# EAGLE design ArduinoNano (EAGLE 8.4.1)
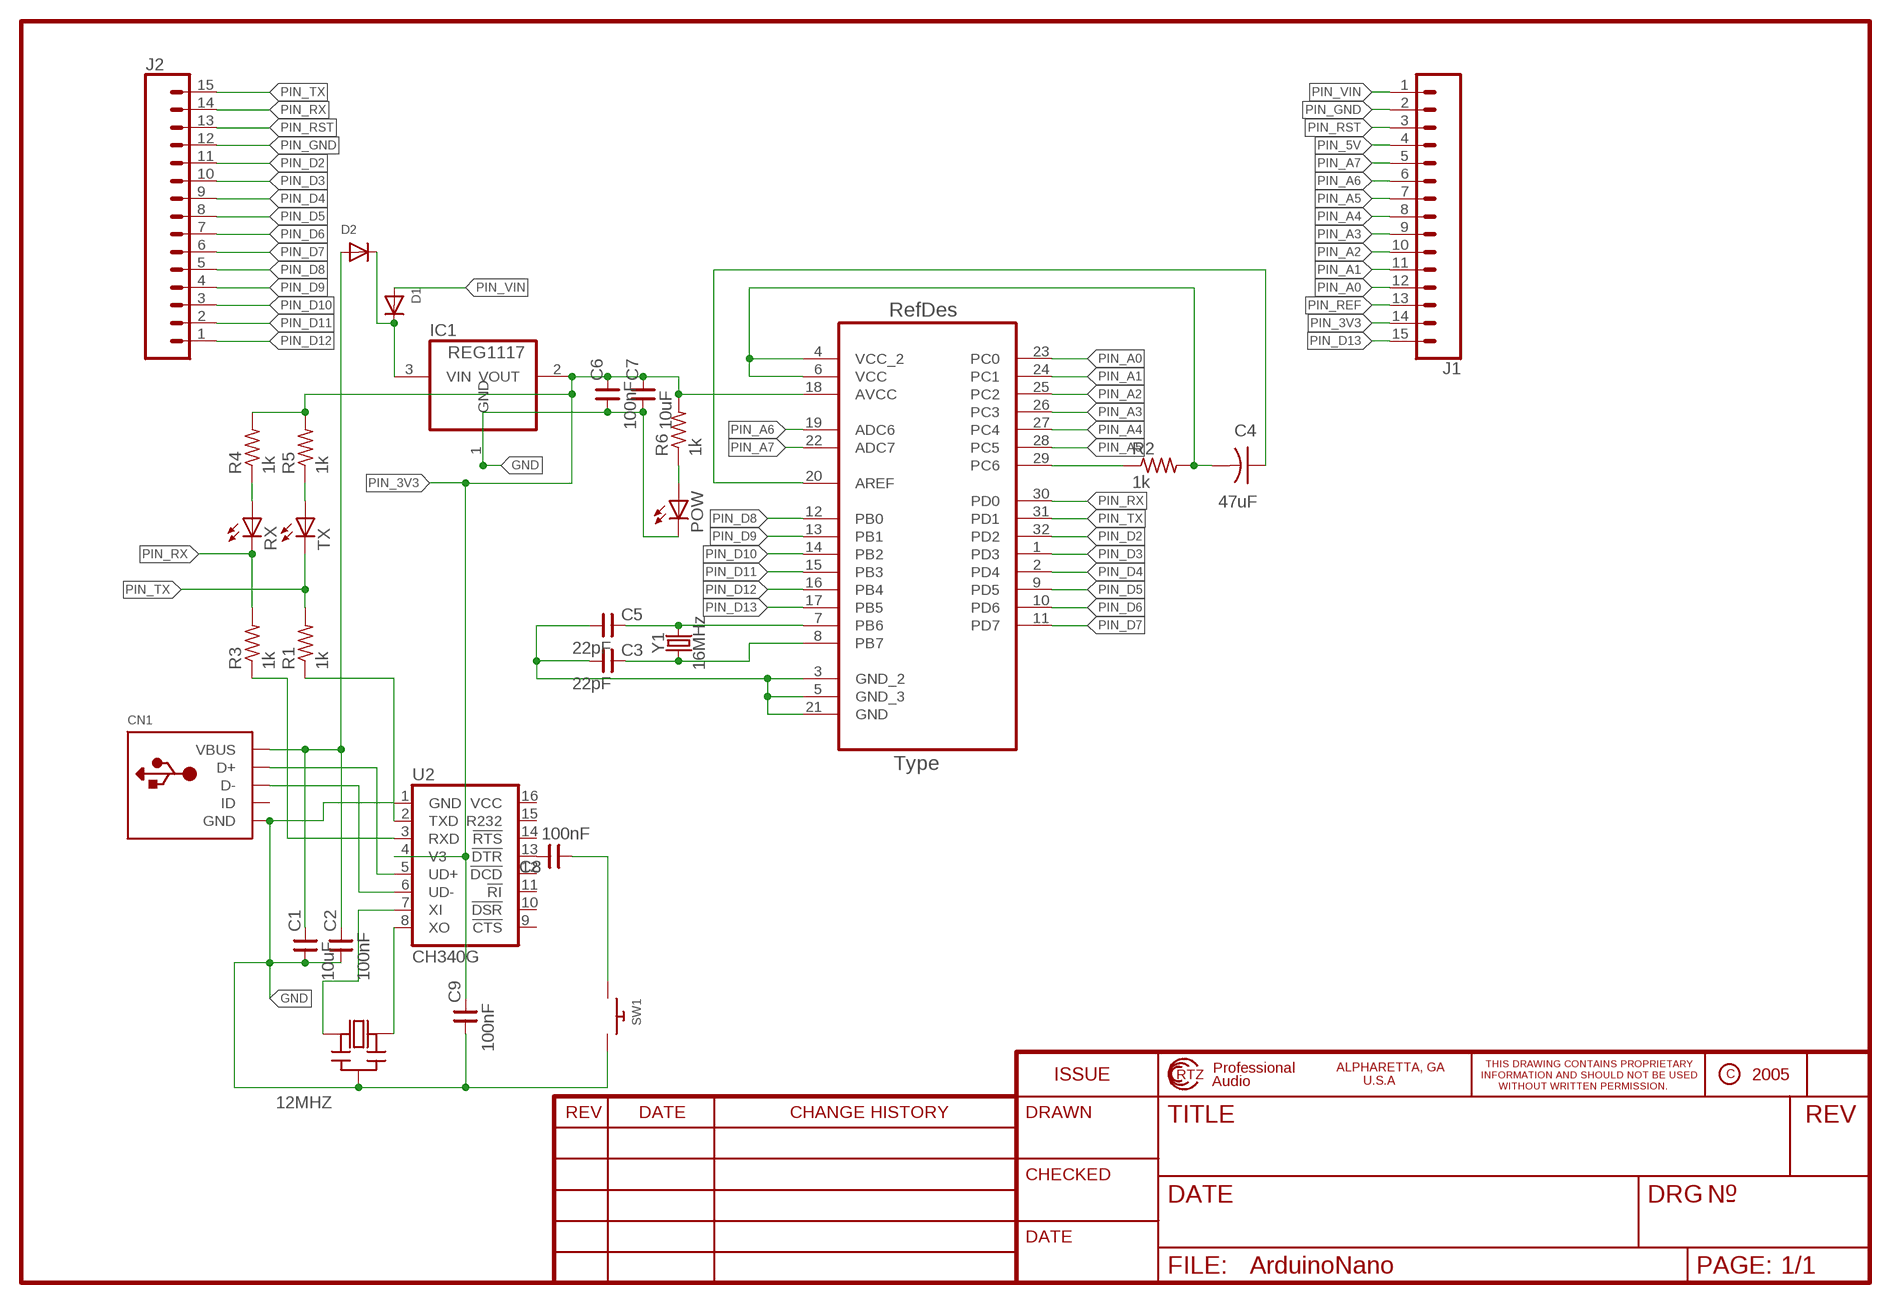
[diagram p0: schematic, sheet 1]

## Parts
12MHZ  CERMOSCILL-THM  [CERM_OSC]
C1  10uF  CNP-0603  [0603]
C2  100nF  CNP-0603  [0603]
C3  22pF  CNP-0603  [0603]
C4  47uF  C-USC1210  [C1210]
C5  22pF  CNP-0603  [0603]
C6  100nF  CNP-0603  [0603]
C7  10uF  CNP-0603  [0603]
C8  100nF  CNP-0603  [0603]
C9  100nF  CNP-0603  [0603]
CN1  USBMINIB  [USB-MINIB]
D1  DIODESOD-323F  [SOD-323F]
D2  DIODESOD-323F  [SOD-323F]
IC1  REG1117  [SOT223]
J1  CONN_15  [1X15]
J2  CONN_15  [1X15]
POW  LEDCHIP-LED0603  [CHIP-LED0603]
R1  1k  R-US_R0603  [R0603]
R2  1k  R-US_R0603  [R0603]
R3  1k  R-US_R0603  [R0603]
R4  1k  R-US_R0603  [R0603]
R5  1k  R-US_R0603  [R0603]
R6  1k  R-US_R0603  [R0603]
RX  LEDCHIPLED_0603  [CHIPLED_0603]
SW1  SWITCH_PUSHBUTTONEVQ-PE  [TACT_PANA-EVQ]
TX  LEDCHIPLED_0603  [CHIPLED_0603]
U1  ATMEGA328P-AU  [QFP80P900X900X120-32N]
U2  CH340G  CH340GSMD  [SO016]
Y1  16MHz  CRYSTAL-16MHZPTH-HC49US  [HC49US]

## Nets
GND: 12MHZ.P$2(GND) C1.1 C2.1 C6.1 C7.1 C9.1 CN1.GND IC1.1(GND) POW.C SW1.P$2 U2.1(GND)
N$1: C5.2 U1.7(PB6) Y1.2
N$2: C3.2 U1.8(PB7) Y1.1
N$3: C3.1 C5.1 U1.3(GND_2) U1.5(GND_3) U1.21(GND)
N$4: C4.1 U1.20(AREF)
N$5: R2.1 U1.29(PC6)
N$6: C4.2 R2.2 U1.4(VCC_2) U1.6(VCC)
N$9: R4.1 RX.A
N$10: R5.1 TX.A
N$11: 12MHZ.P$1(IN) U2.7(XI)
N$12: C1.2 C2.2 CN1.VBUS D2.A
N$13: CN1.D+ U2.5(UD+)
N$14: CN1.D- U2.6(UD-)
N$15: 12MHZ.P$3(OUT) U2.8(XO)
N$16: R3.1 U2.3(RXD)
N$17: R1.1 U2.2(TXD)
N$18: D1.C D2.C IC1.3(VIN)
N$19: C8.2 U2.13(!DTR)
N$21: POW.A R6.1
N$22: C8.1 SW1.P$1
PIN_3V3: C6.2 C7.2 C9.2 IC1.2(VOUT) J1.14 R4.2 R5.2 R6.2 U1.18(AVCC) U2.4(V3)
PIN_5V: J1.4
PIN_A0: J1.12 U1.23(PC0)
PIN_A1: J1.11 U1.24(PC1)
PIN_A2: J1.10 U1.25(PC2)
PIN_A3: J1.9 U1.26(PC3)
PIN_A4: J1.8 U1.27(PC4)
PIN_A5: J1.7 U1.28(PC5)
PIN_A6: J1.6 U1.19(ADC6)
PIN_A7: J1.5 U1.22(ADC7)
PIN_D2: J2.11 U1.32(PD2)
PIN_D3: J2.10 U1.1(PD3)
PIN_D4: J2.9 U1.2(PD4)
PIN_D5: J2.8 U1.9(PD5)
PIN_D6: J2.7 U1.10(PD6)
PIN_D7: J2.6 U1.11(PD7)
PIN_D8: J2.5 U1.12(PB0)
PIN_D9: J2.4 U1.13(PB1)
PIN_D10: J2.3 U1.14(PB2)
PIN_D11: J2.2 U1.15(PB3)
PIN_D12: J2.1 U1.16(PB4)
PIN_D13: J1.15 U1.17(PB5)
PIN_GND: J1.2 J2.12
PIN_REF: J1.13
PIN_RST: J1.3 J2.13
PIN_RX: J2.14 R3.2 RX.C U1.30(PD0)
PIN_TX: J2.15 R1.2 TX.C U1.31(PD1)
PIN_VIN: D1.A J1.1
Unconnected: CN1.ID U2.9(!CTS) U2.10(!DSR) U2.11(!RI) U2.12(!DCD) U2.14(!RTS) U2.15(R232) U2.16(VCC)

## Library data of the parts
12MHZ = adafruit:CERMOSCILL: Ceramic oscillator with built in capacitors such as ZTT-12MHz http://www.ladyada.net/library/eagle
C1-C3 C5-C9 = cap-master:CNP-: NON-POLARIZED CAP
C4 = adafruit:C-US: CAPACITOR, American symbol
CN1 = adafruit:USB: USB Connectors USBMINIB - Surface Mount Female Mini-B USB Connector 4UConnector: 06564 By microbuilder.eu Thru-hole RA Female Mini-B USB Connector 4UConnector: 18732 By ladyada.net
D1 D2 = adafruit:DIODE: Diode SMADIODE - SMA Surface Mount Package 20V 1A Schottky Diode Digikey: 641-1014-6-ND DO-1N4148 - Through Hole Small Current Diode SOD-123 20V 1 A (.5mV Vf) Schottky Diode - Digikey: MBRX120TPMSCT-ND SOD-323 10V 570mA (.38mV Vf, 3ns) Schottky Diode - Digikey: ZLLS410CT-ND SOD-523 30V 30mA Schottky Diode (RB751S-40TE61) - Digikey: RB751S-40TE61CT-ND SOT23-R/W - SOT23 Package (R = Solder Paste/Reflow Ovens, W = Hand-Soldering) BAT54Film 40V 300mA - Digikey: 497-7162-1-ND
IC1 = burr-brown:REG1117: 800mA and 1A Low Dropout (LDO) Positive Regulator 1.8V, 2.5V, 2.85V, 3.3V, 5V, and Adj; MPN: REG1117; OC_FARNELL: 1097566; OC_NEWARK: 14P6981
J1 J2 = SparkFun-Connectors:CONN_15: Multi connection point. Often used as Generic Header-pin footprint for 0.1 inch spaced/style header connections On any of the 0.1 inch spaced packages, you can populate with these: Break Away Headers - Straight <https://www.sparkfun.com/products/116> (PRT-00116) Break Away Male Headers - Right Angle <https://www.sparkfun.com/products/553> (PRT-00553) Female Headers <https://www.sparkfun.com/products/115> (PRT-00115) Break Away Headers - Machine Pin <https://www.sparkfun.com/products/117> (PRT-00117) Break Away Female Headers - Swiss Machine Pin <https://www.sparkfun.com/products/743> (PRT-00743) For SCREWTERMINALS and SPRING TERMINALS visit here: Screw Terimnals on SparkFun.com <https://www.sparkfun.com/search/results?term=Screw+Terminals> (5mm/3.5mm/2.54mm spacing) This device is also useful as a general connection point to wire up your design to another part of your project. Our various solder wires solder well into these plated through hole pads. Hook-Up Wire - Assortment (Stranded, 22 AWG) <https://www.sparkfun.com/products/11375> (PRT-11375) Hook-Up Wire - Assortment (Solid Core, 22 AWG) <https://www.sparkfun.com/products/11367> (PRT-11367) View the entire wire category on our website here <https://www.sparkfun.com/categories/141> Special notes: Molex polarized connector foot print use with SKU : PRT-08231 with associated crimp pins and housings. 1MM SMD Version SKU: PRT-10208 NOTES ON THE VARIANTS LOCK and LOCK_LONGPADS... This footprint was designed to help hold the alignment of a through-hole component (i.e. 6-pin header) while soldering it into place. You may notice that each hole has been shifted either up or down by 0.005 of an inch from it's more standard position (which is a perfectly straight line). This slight alteration caused the pins (the squares in the middle) to touch the edges of the holes. Because they are alternating, it causes a "brace" to hold the component in place. 0.005 has proven to be the perfect amount of "off-center" position when using our standard breakaway headers. Although looks a little odd when you look at the bare footprint, once you have a header in there, the alteration is very hard to notice. Also,if you push a header all the way into place, it is covered up entirely on the bottom side.
POW RX TX = adafruit:LED: LED OSRAM: - CHIPLED LG R971, LG N971, LY N971, LG Q971, LY Q971, LO R971, LY R971 LH N974, LH R974 LS Q976, LO Q976, LY Q976 LO Q996 - Hyper CHIPLED LW Q18S LB Q993, LB Q99A, LB R99A - SideLED LS A670, LO A670, LY A670, LG A670, LP A670 LB A673, LV A673, LT A673, LW A673 LH A674 LY A675 LS A676, LA A676, LO A676, LY A676, LW A676 LS A679, LY A679, LG A679 - Hyper Micro SIDELED® LS Y876, LA Y876, LO Y876, LY Y876 LT Y87S - SmartLED LW L88C, LW L88S LB L89C, LB L89S, LG L890 LS L89K, LO L89K, LY L89K LS L896, LA L896, LO L896, LY L896 - TOPLED LS T670, LO T670, LY T670, LG T670, LP T670 LSG T670, LSP T670, LSY T670, LOP T670, LYG T670 LG T671, LOG T671, LSG T671 LB T673, LV T673, LT T673, LW T673 LH T674 LS T676, LA T676, LO T676, LY T676, LB T676, LH T676, LSB T676, LW T676 LB T67C, LV T67C, LT T67C, LS T67K, LO T67K, LY T67K, LW E67C LS E67B, LA E67B, LO E67B, LY E67B, LB E67C, LV E67C, LT E67C LW T67C LS T679, LY T679, LG T679 LS T770, LO T770, LY T770, LG T770, LP T770 LB T773, LV T773, LT T773, LW T773 LH T774 LS E675, LA E675, LY E675, LS T675 LS T776, LA T776, LO T776, LY T776, LB T776 LHGB T686 LT T68C, LB T68C - Hyper Mini TOPLED® LB M676 - Mini TOPLED Santana® LG M470 LS M47K, LO M47K, LY M47K Source: http://www.osram.convergy.de/
R1-R6 = adafruit:R-US_: RESISTOR, American symbol
SW1 = adafruit:SWITCH_PUSHBUTTON: Buttons SOFTTOUCHSMD_SJ - Soft touch temporary push button (Super Junk Akihabara) Compatible with SKPMANE010 [Mouser: 688-SKPMAN] C&K_KSS = Digikey: KSS221GLFS
U1 = Atmel-ATMEGA328P-AU:ATMEGA328P-AU; DESCRIPTION: 8-bit Microcontroller with In-System Programmable Flash; MPN: ATMEGA328P-AU; OC_FARNELL: 1715486; OC_NEWARK: 14R4631; PACKAGE: TQFP-32; SUPPLIER: Atmel
U2 = Serial-Basic:CH340G: A simple USB 2.0 to Serial IC.; PROD_ID: IC-13498
Y1 = SparkFun-Clocks:CRYSTAL-16MHZ: 16MHz Crystal Digikey Example <http://www.digikey.com/product-search/en?keywords=535-9122-1-ND> Frequency: 16MHz Frequency Stability: ±50ppm Frequency Tolerance: ±20ppm Load Capacitance: 18pF SparkFun Products: Pro Micro -5V/16MHz <https://www.sparkfun.com/products/12640> SparkFun Serial Enabled LCD Kit <https://www.sparkfun.com/products/10097>; PROD_ID: XTAL-08181; SF_ID: COM-00536

## Board
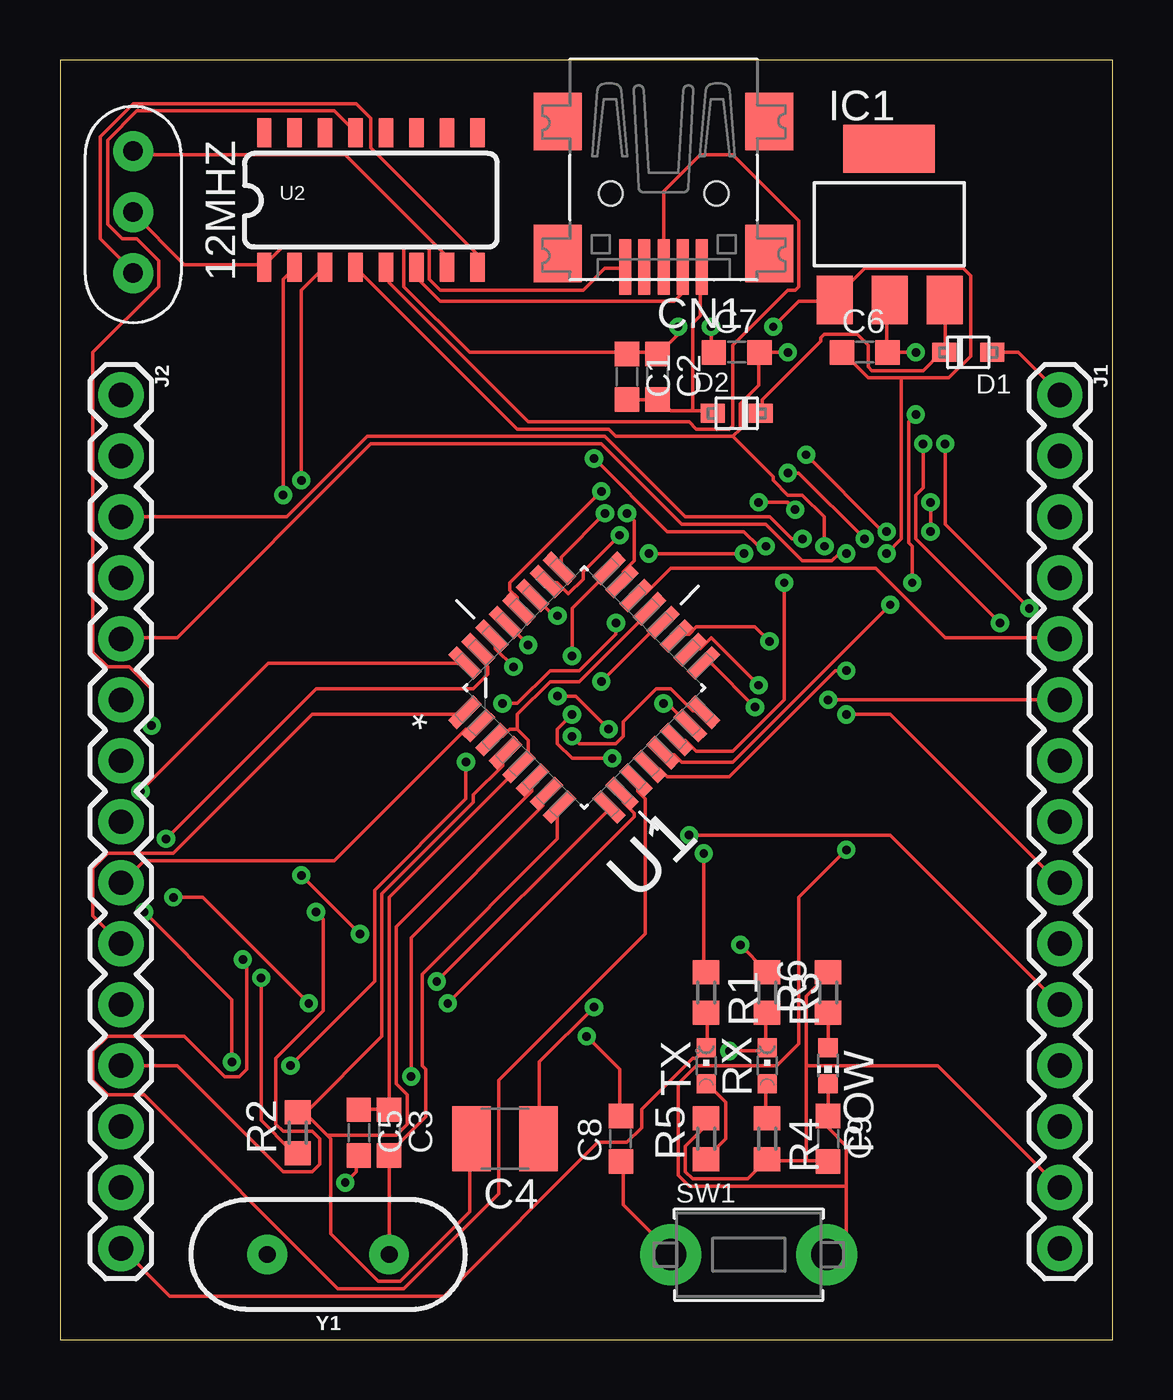
[diagram p1: board, top side]
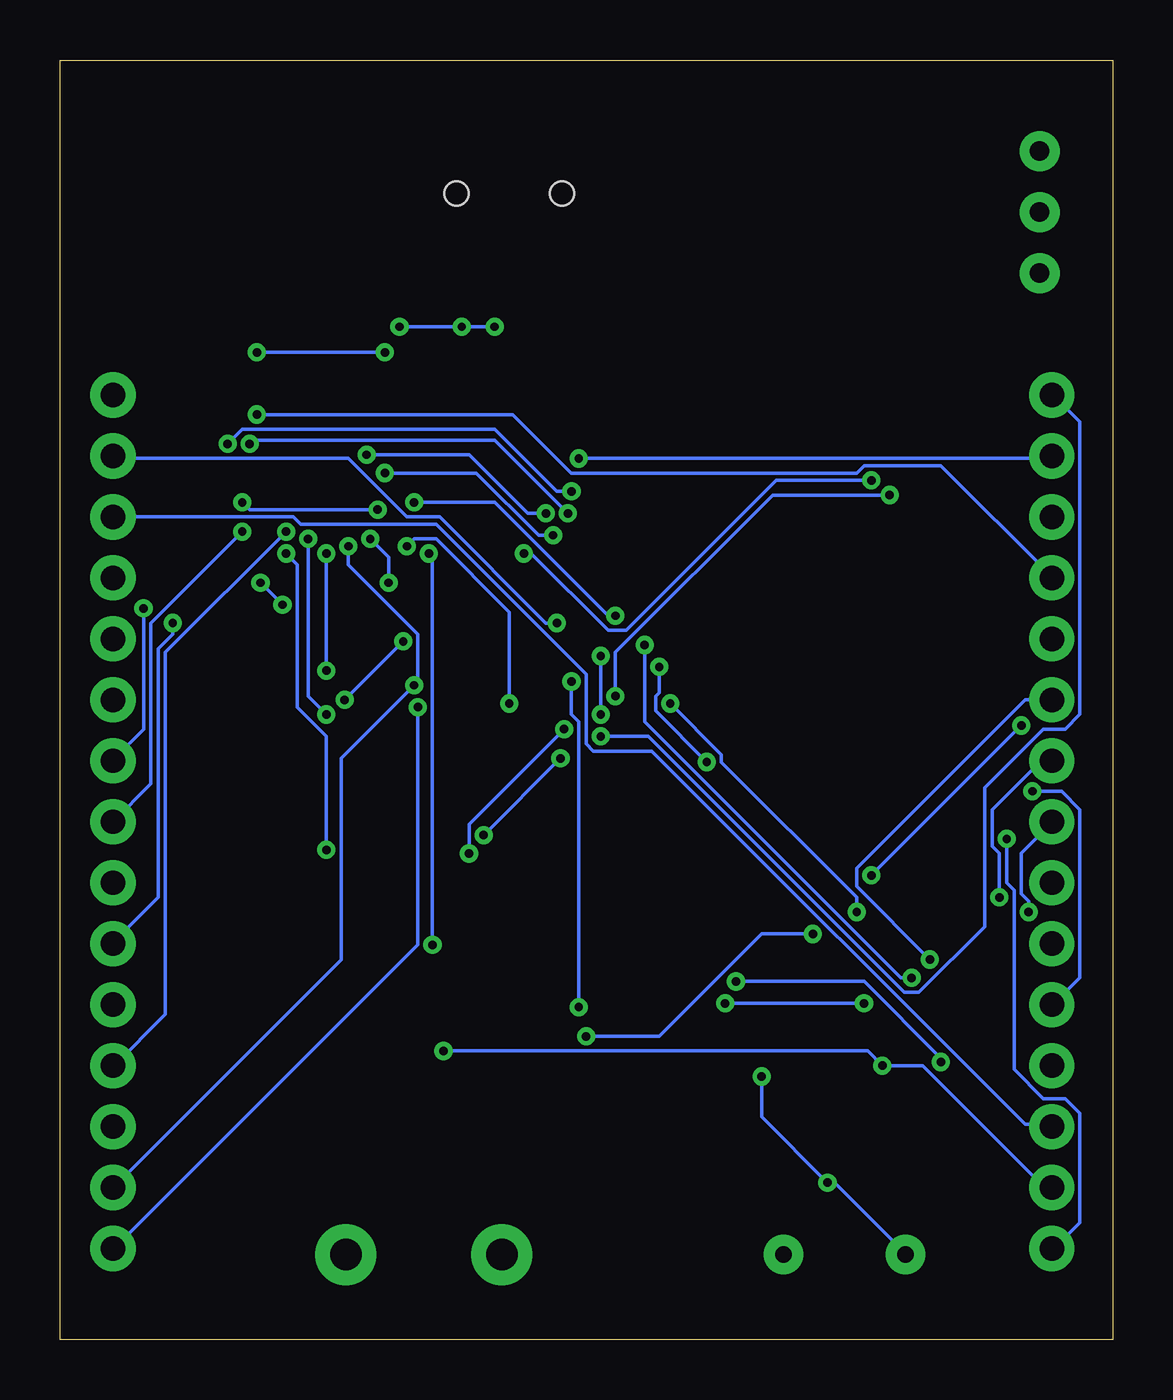
[diagram p2: board, bottom side, seen from below]

Size 43.87 x 53.33 mm. Coordinates in mm from the lower left corner, seen from the top.
Outline: 0,0 43.87,0 43.87,53.33 0,53.33 0,0
Copper layers (1*16): Top 0.035mm / dielectric 1.5mm / Bottom 0.035mm
Design rules "default": minimum track width 6mil, minimum drill 0.35mm, track to track 6mil, track to pad 6mil, pad to pad 6mil, via to via 6mil, smd to smd 6mil, copper to edge 40mil, drill to drill 6mil, minimum pad ring 10mil, minimum via ring 8mil, stop-mask expansion 4mil, vias tented up to drill 0mil, thermal gap 10mil

### Footprints (pad centres in the part's own frame; a part is rotated, then mirrored left to right if it is on the bottom)
CERM_OSC = drill 0.813 pad 1.676: P$1 -2.54,0; P$2 0,0; P$3 2.54,0
0603 = smd 1.016 x 1.016: 1 -0.953,0; 2 0.953,0
C1210 = smd 1.6 x 2.7: 1 -1.4,0; 2 1.4,0
USB-MINIB = smd 0.5 x 2.308: D+ 0,4.064; D- -0.8,4.064; GND 1.6,4.064; ID 0.8,4.064; VBUS -1.6,4.064 | smd 2 x 2.4: GND1 -4.4,-2; GND2 -4.4,3.5; GND3 4.4,3.5; GND4 4.4,-2 | hole 1: -2.2,1; 2.2,1
SOD-323F = smd 1 x 0.8: A -1,0; C 1,0
SOT223 = smd 1.499 x 2.007: 1 -2.261,-3.15; 2 0.025,-3.15; 3 2.311,-3.15 | smd 3.81 x 2.007: 4 0,3.15
1X15 = drill 1.016 pad 1.88: 1 0,0; 2 2.54,0; 3 5.08,0; 4 7.62,0; 5 10.16,0; 6 12.7,0; 7 15.24,0; 8 17.78,0; 9 20.32,0; 10 22.86,0; 11 25.4,0; 12 27.94,0; 13 30.48,0; 14 33.02,0; 15 35.56,0
CHIP-LED0603 = smd 0.8 x 0.8: A 0,-0.75; C 0,0.75
R0603 = smd 1 x 1.1: 1 -0.85,0; 2 0.85,0
CHIPLED_0603 = smd 0.8 x 0.8: A 0,-0.75; C 0,0.75
TACT_PANA-EVQ = drill 1.3 pad 2.54: P$1 -3.25,0; P$2 3.25,0
QFP80P900X900X120-32N = smd 1.473 x 0.508: 1 -4.242,2.794; 2 -4.242,2.007; 3 -4.242,1.194; 4 -4.242,0.406; 5 -4.242,-0.406; 6 -4.242,-1.194; 7 -4.242,-2.007; 8 -4.242,-2.794; 17 4.242,-2.794; 18 4.242,-2.007; 19 4.242,-1.194; 20 4.242,-0.406; 21 4.242,0.406; 22 4.242,1.194; 23 4.242,2.007; 24 4.242,2.794 | smd 0.508 x 1.473: 9 -2.794,-4.242; 10 -2.007,-4.242; 11 -1.194,-4.242; 12 -0.406,-4.242; 13 0.406,-4.242; 14 1.194,-4.242; 15 2.007,-4.242; 16 2.794,-4.242; 25 2.794,4.242; 26 2.007,4.242; 27 1.194,4.242; 28 0.406,4.242; 29 -0.406,4.242; 30 -1.194,4.242; 31 -2.007,4.242; 32 -2.794,4.242
SO016 = smd 0.6 x 1.2: 1 -4.445,-2.8; 2 -3.175,-2.8; 3 -1.905,-2.8; 4 -0.635,-2.8; 5 0.635,-2.8; 6 1.905,-2.8; 7 3.175,-2.8; 8 4.445,-2.8; 9 4.445,2.8; 10 3.175,2.8; 11 1.905,2.8; 12 0.635,2.8; 13 -0.635,2.8; 14 -1.905,2.8; 15 -3.175,2.8; 16 -4.445,2.8
HC49US = drill 0.7 pad 1.651: 1 -2.54,0; 2 2.54,0

### Placement (x,y rotation side)
12MHZ  3.05,46.99 270 top
C1  23.62,40.13 270 top
C2  24.89,40.13 270 top
C3  13.72,8.64 270 top
C4  18.54,8.38 180 top
C5  12.45,8.64 270 top
C6  33.53,41.15 0 top
C7  28.19,41.15 0 top
C8  23.37,8.38 90 top
C9  32,8.38 270 top
CN1  25.15,48.77 180 top
D1  37.85,41.15 180 top
D2  28.19,38.61 0 top
IC1  34.54,46.48 0 top
J1  41.66,39.37 270 top
J2  2.54,39.37 270 top
POW  32,11.43 180 top
R1  26.92,14.48 270 top
R2  9.91,8.64 90 top
R3  29.46,14.48 270 top
R4  29.46,8.38 270 top
R5  26.92,8.38 90 top
R6  32,14.48 90 top
RX  29.46,11.43 0 top
SW1  28.7,3.56 0 top
TX  26.92,11.43 0 top
U1  21.84,27.18 45 top
U2  12.95,47.5 0 top
Y1  11.18,3.56 180 top

### Tracks (layer width: path | path; a pad name or v marks a point on that pad's centre or on a via)
GND  (via drill 0.35)
  Top 0.152: POW.C C9.1 32,8.84 32.77,8.08 32.77,6.4 | 32.77,6.4 32.77,4.42 32,3.66 SW1.P$2 | 35.05,40.08 37.03,40.08 37.95,41 37.95,44.35 37.64,44.65 33.53,44.65 32.31,43.43 IC1.1 32.16,43.28 30.79,43.28 v29.72,42.22 | 35.05,40.08 33.68,40.08 32.61,41.15 C6.1 | 23.62,41.15 24.84,41.15 C2.1 24.99,41.15 25.76,41.91 v25.76,42.22 | v27.13,42.22 27.13,41.15 C7.1 | 12MHZ.P$2 3.05,46.94 5.18,44.81 8.38,44.81 U2.1 8.53,44.81 9.3,45.57 14.33,45.57 | 14.33,45.57 15.24,45.57 15.39,45.41 15.39,44.2 15.85,43.74 21.79,43.74 22.71,44.65 23.47,44.65 CN1.GND | 23.62,41.15 17.07,41.15 14.33,43.89 14.33,45.57 | 23.62,41.15 C1.1 | 32.77,6.4 26.21,6.4 25.76,6.86 25.76,10.67 26.52,11.43 29.87,11.43 30.79,12.34 30.79,18.44 v32.77,20.42 | v34.44,32.77 35.05,33.38 35.05,40.08
  Bottom 0.152: v25.76,42.22 v27.13,42.22 v29.72,42.22 | v32.77,20.42 32.77,25.15 33.98,26.36 33.98,32.31 v34.44,32.77
N$1  (via drill 0.35)
  Top 0.152: v11.89,6.55 12.34,7.01 12.34,7.62 C5.2 | v14.63,10.97 14.63,16.76 20.12,22.25 20.12,22.71 U1.7
  Bottom 0.152: Y1.2 8.69,3.66 11.58,6.55 v11.89,6.55 14.63,9.3 v14.63,10.97
N$2
  Top 0.152: Y1.1 C3.2 13.72,7.77 15.24,9.3 15.24,11.28 15.09,11.43 15.09,15.24 20.73,20.88 20.73,22.1 U1.8
N$3
  Top 0.152: 13.72,9.6 12.5,9.6 C5.1 | 13.72,9.6 13.72,18.44 19.05,23.77 U1.5 19.2,23.93 19.51,24.23 19.51,24.99 19.05,25.45 | 13.72,9.6 C3.1 | 19.05,25.45 18.75,25.45 18.44,25.15 18.14,25.15 U1.3 | 19.05,25.45 19.05,26.06 20.42,27.43 21.64,27.43 24.54,30.33 U1.21
N$4  (via drill 0.35)
  Top 0.152: v22.55,27.43 24.99,29.87 U1.20 | v22.25,13.87 19.96,11.58 19.96,8.38 C4.1
  Bottom 0.152: v22.55,27.43 22.55,26.06 22.25,25.76 v22.25,13.87
N$5  (via drill 0.35)
  Top 0.152: v8.38,15.09 8.38,9.14 9.6,7.92 9.91,7.92 R2.1 | v19.51,28.96 18.59,29.87 U1.29
  Bottom 0.152: v8.38,15.09 8.84,15.09 19.51,25.76 v19.51,28.96
N$6
  Top 0.152: 10.21,9.45 9.91,9.45 R2.2 10.21,9.45 | 11.12,8.53 11.28,8.38 11.28,4.42 13.26,2.44 14.17,2.44 17.07,5.33 17.07,8.38 C4.2 | 11.12,8.53 10.21,9.45 | 11.12,8.53 14.02,8.53 14.48,8.99 14.48,10.21 14.02,10.67 14.02,17.22 19.66,22.86 19.66,23.32 U1.6 | 10.21,9.45 13.41,12.65 13.41,18.59 17.22,22.4 17.22,22.71 18.44,23.93 18.44,24.38 U1.4
N$9
  Top 0.152: RX.A 29.41,10.67 29.41,9.3 R4.1
N$10
  Top 0.152: TX.A 26.98,10.67 27.74,9.91 27.74,8.38 26.98,7.62 R5.1
N$11
  Top 0.152: 12MHZ.P$1 3.2,49.38 11.89,49.38 16,45.26 16,44.81 U2.7
N$12
  Top 0.152: 26.36,38.71 25.45,38.71 24.99,39.17 C2.2 24.84,39.17 23.62,39.17 C1.2 | 26.36,38.71 27.13,38.71 D2.A | 26.36,38.71 26.36,42.37 26.67,42.67 26.67,44.65 CN1.VBUS
N$13
  Top 0.152: CN1.D+ 25.15,47.85 26.67,49.38 28.04,49.38 30.79,46.63 30.79,43.89 30.63,43.74 30.33,43.74 28.04,41.45 28.04,38.1 27.89,37.95 26.52,37.95 26.21,38.25 19.51,38.25 13.72,44.04 13.72,44.65 U2.5
N$14
  Top 0.152: U2.6 14.94,44.65 14.94,44.2 15.85,43.28 25.6,43.28 25.91,43.59 25.91,44.65 CN1.D-
N$15
  Top 0.152: U2.8 17.37,44.81 17.37,45.26 12.95,49.68 12.95,50.9 12.34,51.51 3.05,51.51 1.68,50.14 1.68,45.87 3.05,44.5 12MHZ.P$3
N$16  (via drill 0.35)
  Top 0.152: v28.35,16.46 29.41,15.39 R3.1 | v24.54,32.77 v28.5,32.77 | v10.06,35.81 10.06,43.74 10.97,44.65 U2.3
  Bottom 0.152: v28.35,16.46 28.35,32.61 v28.5,32.77 | v24.54,32.77 24.23,32.77 21.03,29.57 20.27,29.57 14.02,35.81 v10.06,35.81
N$17  (via drill 0.35)
  Top 0.152: v26.82,20.27 26.82,15.39 R1.1 | v22.86,25.45 21.49,26.82 v20.73,26.82 | v9.3,35.2 9.3,44.2 9.75,44.65 U2.2
  Bottom 0.152: v26.82,20.27 26.82,21.49 v22.86,25.45 | v20.73,26.82 20.73,28.65 14.17,35.2 v9.3,35.2
N$18
  Top 0.152: D2.C 29.26,38.71 29.26,39.17 31.7,41.6 31.7,41.76 31.85,41.91 33.22,41.91 33.68,41.45 33.68,40.54 33.83,40.39 35.97,40.39 36.73,41.15 D1.C 36.88,41.15 36.88,43.28 IC1.3
N$19  (via drill 0.35)
  Top 0.152: v21.95,12.65 23.32,11.28 23.32,9.45 C8.2 | v10.06,19.36 v12.5,16.92 | v3.81,25.6 3.81,27.13 2.9,28.04 1.98,28.04 1.37,28.65 1.37,41.15 4.12,43.89 4.12,44.96 3.2,45.87 2.59,45.87 1.98,46.48 1.98,49.99 3.2,51.21 11.43,51.21 12.19,50.44 U2.13
  Bottom 0.152: v21.95,12.65 18.9,12.65 14.63,16.92 v12.5,16.92 | v3.81,25.6 v10.06,19.36
N$21
  Top 0.152: R6.1 POW.A
N$22
  Top 0.152: C8.1 23.47,7.32 23.47,5.64 25.45,3.66 SW1.P$1
PIN_3V3  (via drill 0.35)
  Top 0.152: IC1.2 34.44,43.28 34.44,41.15 C6.2 v35.66,41.15 | 28.04,37.64 28.35,37.95 28.35,39.01 29.11,39.78 29.11,41.15 C7.2 v30.33,41.15 | 28.04,37.64 23.16,37.64 22.86,37.95 19.05,37.95 12.34,44.65 U2.4 | 31.09,7.47 29.57,7.47 R4.2 29.41,7.47 28.65,6.71 26.36,6.71 26.06,7.01 26.06,8.08 26.82,8.84 26.82,9.14 R5.2 | 31.09,7.47 32,7.47 C9.2 | 31.09,7.47 31.09,11.43 | 31.09,11.43 31.09,14.33 32,15.24 R6.2 | v29.11,27.28 27.13,29.26 26.67,28.8 26.36,28.8 U1.18 | 31.09,11.43 36.58,11.43 J1.14 | 28.04,37.64 29.72,35.97 29.72,35.81 30.33,35.2 30.94,35.2 31.85,34.29 v31.85,33.07
  Bottom 0.152: v30.33,41.15 v35.66,41.15 | J1.14 32.16,15.85 32.16,24.23 v29.11,27.28 28.96,27.43 28.96,29.41 31.85,32.31 v31.85,33.07
PIN_A0  (via drill 0.35)
  Top 0.152: v23.62,34.44 23.93,34.14 23.93,32.46 23.47,32 23.47,31.7 U1.23 | v31.09,36.88 34.29,33.68 v34.44,33.68
  Bottom 0.152: v23.62,34.44 24.38,34.44 26.82,36.88 v31.09,36.88 | v34.44,33.68 39.47,28.65 39.47,13.56 41.6,11.43 J1.12
PIN_A1  (via drill 0.35)
  Top 0.152: v21.34,28.5 21.34,30.48 22.86,32 U1.24 | v21.34,26.06 20.73,25.45 20.73,24.84 21.34,24.23 v23.01,24.23 | v26.21,21.03 34.59,21.03 J1.11
  Bottom 0.152: v21.34,26.06 v21.34,28.5 | v26.21,21.03 v23.01,24.23
PIN_A2  (via drill 0.35)
  Top 0.152: v22.71,34.44 20.88,32.61 20.88,32.16 U1.25 | v35.97,37.34 35.97,35.51 35.66,35.2 35.66,33.38 v39.17,29.87
  Bottom 0.152: v22.71,34.44 25.76,37.49 35.81,37.49 v35.97,37.34 | v39.17,29.87 39.17,29.41 39.78,28.8 39.78,18.44 41.6,16.61 J1.10
PIN_A3  (via drill 0.35)
  Top 0.152: v23.32,33.53 21.79,32 21.79,31.7 21.18,31.09 20.73,31.55 20.27,31.55 U1.26 | v30.33,36.12 30.79,36.12 v33.53,33.38 | v32.77,26.06 34.59,26.06 41.6,19.05 J1.9
  Bottom 0.152: v23.32,33.53 23.93,33.53 26.52,36.12 v30.33,36.12 | v33.53,33.38 33.53,26.82 v32.77,26.06
PIN_A4  (via drill 0.35)
  Top 0.152: v20.73,30.18 20.57,30.18 19.81,30.94 U1.27 | v29.11,34.9 30.33,34.9 v30.63,34.59 | v36.27,33.68 v36.27,34.9
  Bottom 0.152: v20.73,30.18 21.03,30.18 25.76,34.9 v29.11,34.9 | v30.63,34.59 35.97,34.59 v36.27,34.9 | v36.27,33.68 40.08,29.87 40.08,23.16 J1.8
PIN_A5  (via drill 0.35)
  Top 0.152: v22.55,35.36 18.75,31.55 18.75,31.24 19.05,30.94 19.05,30.48 U1.28 | v36.88,37.34 36.88,33.98 v40.39,30.48
  Bottom 0.152: v22.55,35.36 23.16,35.36 25.76,37.95 36.27,37.95 v36.88,37.34 | v40.39,30.48 40.39,25.45 41.6,24.23 J1.7
PIN_A6  (via drill 0.35)
  Top 0.152: v29.57,29.11 28.96,29.72 26.52,29.72 26.21,29.41 25.76,29.41 U1.19 | J1.6 v32,26.67
  Bottom 0.152: v32,26.67 v29.57,29.11
PIN_A7
  Top 0.152: U1.22 24.08,31.09 24.38,31.09 25.45,32.16 33.98,32.16 36.88,29.26 41.6,29.26 J1.5
PIN_D2  (via drill 0.35)
  Top 0.152: v3.35,22.86 8.69,28.19 16.76,28.19 U1.32
  Bottom 0.152: v3.35,22.86 2.13,22.86 1.37,22.1 1.37,15.09 2.44,14.02 J2.11
PIN_D3
  Top 0.152: J2.10 1.37,17.68 1.37,19.66 1.98,20.27 4.72,20.27 10.52,26.06 16.76,26.06 U1.1
PIN_D4
  Top 0.152: U1.2 17.37,25.45 16.92,25.45 11.43,19.96 3.5,19.96 2.59,19.05 J2.9
PIN_D5  (via drill 0.35)
  Top 0.152: v15.7,14.94 22.86,22.1 U1.9 | v7.16,11.58 7.16,14.17 v3.5,17.83
  Bottom 0.152: v15.7,14.94 10.36,14.94 7.16,11.73 v7.16,11.58 | v3.5,17.83 3.5,18.29 3.81,18.59 3.81,20.27 2.59,21.49 J2.8
PIN_D6  (via drill 0.35)
  Top 0.152: v16.15,14.02 23.93,21.79 23.93,21.95 23.47,22.4 23.47,22.71 U1.10 | v10.36,14.02 5.94,18.44 v4.72,18.44
  Bottom 0.152: v10.36,14.02 v16.15,14.02 | v4.72,18.44 4.72,20.27 5.03,20.57 5.03,22.1 3.05,24.08 2.59,24.08 J2.7
PIN_D7  (via drill 0.35)
  Top 0.152: v7.62,15.85 7.77,15.7 7.77,11.28 7.47,10.97 6.86,10.97 5.18,12.65 1.98,12.65 1.37,12.04 1.37,10.82 1.98,10.21 3.5,10.21 11.58,2.13 14.33,2.13 18.29,6.1 18.29,10.82 24.38,16.92 24.38,22.55 24.08,22.86 24.08,23.32 U1.11
  Bottom 0.152: v7.62,15.85 10.67,18.9 10.67,19.66 3.66,26.67 J2.6
PIN_D8  (via drill 0.35)
  Top 0.152: v32.77,27.89 32.31,27.89 27.89,23.47 25.3,23.47 24.99,23.77 24.69,23.77 U1.12 | v32.77,32.77 32.46,32.77 32.16,32.46 30.94,32.46 29.41,33.98 25.91,33.98 22.55,37.34 12.95,37.34 4.88,29.26 2.59,29.26 J2.5
  Bottom 0.152: v32.77,32.77 v32.77,27.89
PIN_D9  (via drill 0.35)
  Top 0.152: v34.59,30.63 28.04,24.08 25.91,24.08 25.6,24.38 25.15,24.38 U1.13 | v35.51,31.55 35.51,33.07 35.36,33.22 35.36,38.25 v35.66,38.56
  Bottom 0.152: v35.51,31.55 v34.59,30.63 | v35.66,38.56 24.99,38.56 22.55,36.12 10.67,36.12 10.36,36.42 7.16,36.42 2.59,31.85 J2.4
PIN_D10  (via drill 0.35)
  Top 0.152: v30.18,31.55 30.18,26.67 28.04,24.54 26.52,24.54 26.06,24.99 25.76,24.99 U1.14 | v30.94,33.38 30.48,33.38 29.57,34.29 26.06,34.29 22.71,37.64 12.8,37.64 9.45,34.29 J2.3
  Bottom 0.152: v30.18,31.55 30.18,32.61 v30.94,33.38
PIN_D11  (via drill 0.35)
  Top 0.152: v25.15,26.52 25.3,26.52 26.21,25.6 U1.15 | v29.41,33.07 29.11,33.07 28.5,33.68 25.3,33.68 v22.25,36.73
  Bottom 0.152: v25.15,26.52 25.15,30.33 28.19,33.38 29.11,33.38 v29.41,33.07 | v22.25,36.73 2.59,36.73 J2.2
PIN_D12  (via drill 0.35)
  Top 0.152: v21.34,25.15 21.64,24.84 23.16,24.84 23.47,25.15 23.47,25.76 24.84,27.13 25.45,27.13 26.36,26.21 26.67,26.21 U1.16
  Bottom 0.152: v21.34,25.15 19.36,25.15 8.69,14.48 8.08,14.48 5.33,17.22 5.33,23.01 2.9,25.45 1.98,25.45 1.37,26.06 1.37,38.25 2.44,39.32 J2.1
PIN_D13  (via drill 0.35)
  Top 0.152: v28.96,26.36 27.13,28.19 U1.17
  Bottom 0.152: v28.96,26.36 28.96,16.46 41.6,3.81 J1.15
PIN_GND  (via drill 0.35)
  Top 0.152: J2.12 4.88,11.43 9.3,7.01 10.52,7.01 10.82,7.32 10.82,8.38 10.52,8.69 9.3,8.69 8.99,8.99 8.99,11.73 10.97,13.72 10.97,17.53 v10.67,17.83 | v18.44,26.52 19.05,26.52 20.42,27.89 21.64,27.89 23.16,29.41 v23.16,29.87
  Bottom 0.152: v10.67,17.83 10.67,18.44 16.31,24.08 16.31,24.38 v18.44,26.52 | v23.16,29.87 23.62,29.87 28.04,34.29 29.41,34.29 31.85,36.73 41.6,36.73 J1.2
PIN_RST
  Bottom 0.152: J1.3 34.14,34.29 33.83,33.98 28.19,33.98 21.95,27.74 21.95,24.84 21.64,24.54 19.2,24.54 3.66,8.99 2.59,8.99 J2.13
PIN_RX  (via drill 0.35)
  Top 0.152: R3.2 29.41,13.56 29.41,12.19 RX.C 29.41,12.04 v27.89,12.04 | v18.9,28.04 18.14,28.8 18.14,29.26 U1.30 | v16.92,24.08 16.92,22.55 13.11,18.75 13.11,14.94 v9.6,11.43
  Bottom 0.152: v18.9,28.04 18.9,26.98 19.05,26.82 19.05,26.21 v16.92,24.08 | J2.14 2.59,6.4 2.9,6.4 7.92,11.43 v9.6,11.43 10.21,12.04 v27.89,12.04
PIN_TX  (via drill 0.35)
  Top 0.152: R1.2 26.98,13.56 26.98,12.19 TX.C 26.82,12.04 26.52,11.73 26.36,11.73 24.23,9.6 24.23,8.84 23.62,8.23 22.4,8.23 16,1.83 4.57,1.83 2.59,3.81 J2.15 | v4.42,20.88 10.67,27.13 17.22,27.13 17.83,27.74 17.83,28.04 17.53,28.35 17.53,28.65 U1.31
  Bottom 0.152: v4.42,20.88 4.42,19.05 4.12,18.75 4.12,11.28 2.9,10.06 1.98,10.06 1.37,9.45 1.37,4.88 2.44,3.81 J2.15
PIN_VIN
  Top 0.152: D1.A 39.93,41.15 41.6,39.47 J1.1